# EAGLE design shield-ble (EAGLE 6.5.0)
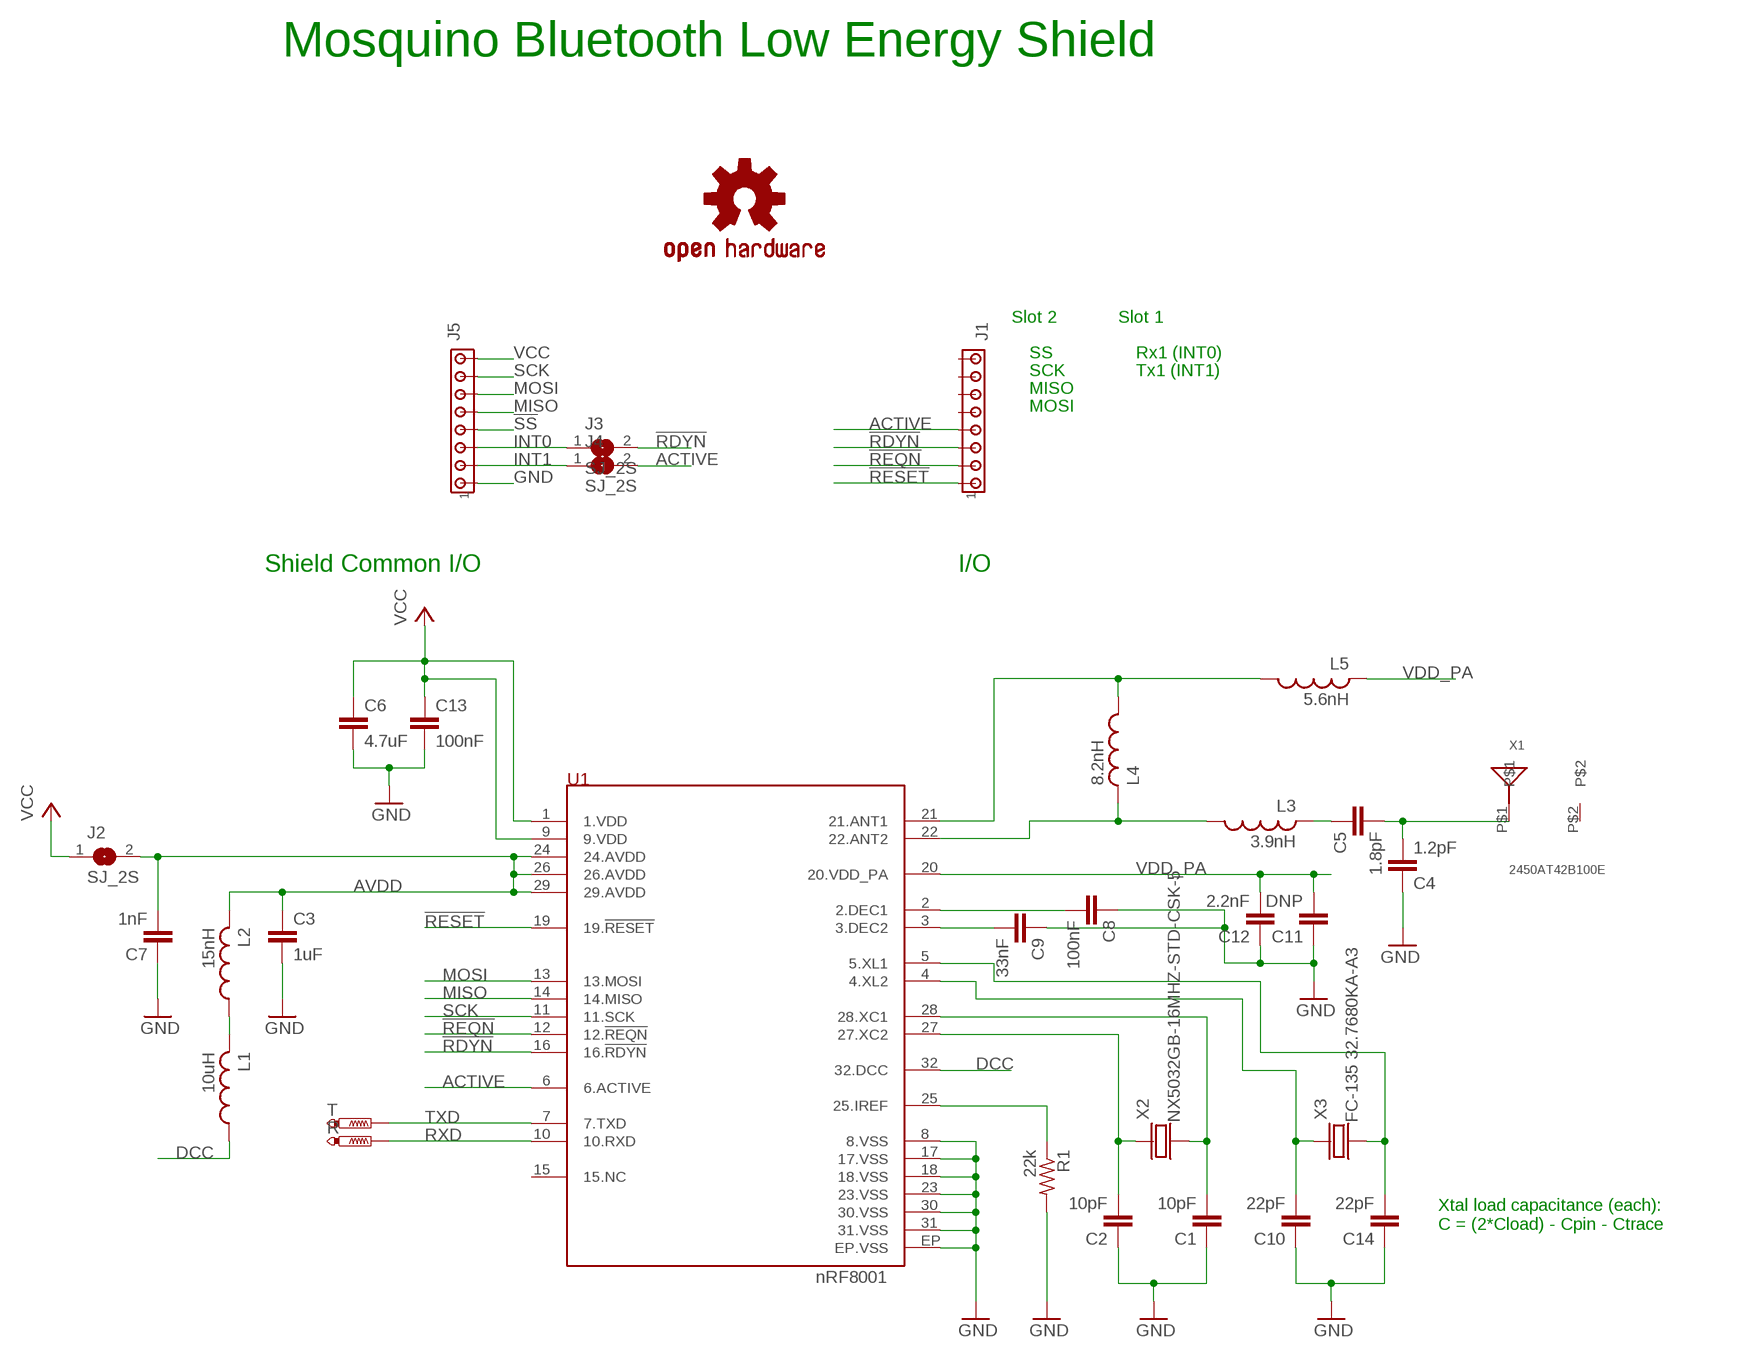
[diagram p0: schematic, sheet 1]

## Parts
C1  10pF  C-EUC0603  [C0603]
C2  10pF  C-EUC0603  [C0603]
C3  1uF  C-EUC0603  [C0603]
C4  1.2pF  C-EUC0603  [C0603]
C5  1.8pF  C-EUC0603  [C0603]
C6  4.7uF  C-EUC0603  [C0603]
C7  1nF  C-EUC0603  [C0603]
C8  100nF  C-EUC0603  [C0603]
C9  33nF  C-EUC0603  [C0603]
C10  22pF  C-EUC0603  [C0603]
C11  DNP  C-EUC0603  [C0603]
C12  2.2nF  C-EUC0603  [C0603]
C13  100nF  C-EUC0603  [C0603]
C14  22pF  C-EUC0603  [C0603]
J1  MTA08-100  [10X08MTA]
J2  SJ_2S  [SJ2_S]
J3  SJ_2S  [SJ2_S]
J4  SJ_2S  [SJ2_S]
J5  MTA08-100  [10X08MTA]
L1  10uH  L-GENERIC0603  [0603]
L2  15nH  L-GENERIC0603  [0603]
L3  3.9nH  L-GENERIC0603  [0603]
L4  8.2nH  L-GENERIC0603  [0603]
L5  5.6nH  L-GENERIC0603  [0603]
LOGO1  OSHW-LOGOS  [OSHW-LOGO-S]
R  PTR1PAD1-13  [P1-13]
R1  22k  R-US_R0603  [R0603]
T  PTR1PAD1-13  [P1-13]
U1  NRF8001_QFN32  [QFN-32]
X1  2450AT42B100E  ANTENNA_CHIP_5MMX2MM  [ANTENNA_CHIP_5MMX2MM]
X2  NX5032GB-16MHZ-STD-CSK-5  CRYSTAL_SMD_5X3POINT2MM  [CRYSTAL_SMD_5X3POINT2MM]
X3  FC-135 32.7680KA-A3  FC-135  [FC-135]

## Nets
!RDYN: J1.3 J3.2 U1.16(16.!RDYN)
!REQN: J1.2 U1.12(12.!REQN)
!RESET: J1.1 U1.19(19.!RESET)
!SS: J5.4
ACTIVE: J1.4 J4.2 U1.6(6.ACTIVE)
AVDD: C3.1 C7.2 J2.2 L2.2 U1.24(24.AVDD) U1.26(26.AVDD) U1.29(29.AVDD)
DCC: L1.1 U1.32(32.DCC)
GND: C1.1 C2.1 C3.2 C4.1 C6.2 C7.1 C8.1 C9.1 C10.1 C11.1 C12.1 C13.2 C14.1 J5.1 R1.2 U1.8(8.VSS) U1.17(17.VSS) U1.18(18.VSS) U1.23(23.VSS) U1.30(30.VSS) U1.31(31.VSS) U1.EP(EP.VSS)
INT0: J3.1 J5.3
INT1: J4.1 J5.2
MISO: J5.5 U1.14(14.MISO)
MOSI: J5.6 U1.13(13.MOSI)
N$4: L1.2 L2.1
N$5: C2.2 U1.27(27.XC2) X2.P$1(X1)
N$6: C1.2 U1.28(28.XC1) X2.P$2(X2)
N$7: C10.2 U1.4(4.XL2) X3.P$1(X1)
N$8: C14.2 U1.5(5.XL1) X3.P$2(X2)
N$15: C5.1 L3.2
N$16: L3.1 L4.2 U1.22(22.ANT2)
N$17: L4.1 L5.1 U1.21(21.ANT1)
N$18: C8.2 U1.2(2.DEC1)
N$19: C9.2 U1.3(3.DEC2)
N$21: R1.1 U1.25(25.IREF)
N$22: C4.2 C5.2 X1.P$1
RXD: R.TP U1.10(10.RXD)
SCK: J5.7 U1.11(11.SCK)
TXD: T.TP U1.7(7.TXD)
VCC: C6.1 C13.1 J2.1 J5.8 U1.1(1.VDD) U1.9(9.VDD)
VDD_PA: C11.2 C12.2 L5.2 U1.20(20.VDD_PA)
Unconnected: J1.5 J1.6 J1.7 J1.8 U1.15(15.NC) X1.P$2

## Notes on the sheet
- Mosquino Bluetooth Low Energy Shield
- Slot 2 | Slot 1
- SS | Rx1 (INT0)
- SCK | Tx1 (INT1)
- MISO
- MOSI
- Shield Common I/O | I/O
- Xtal load capacitance (each):
  C = (2*Cload) - Cpin - Ctrace

## Library data of the parts
C1-C14 = rcl:C-EU: CAPACITOR, European symbol
J1 J5 = con-amp:MTA08-100: AMP connector
J2-J4 = mideeval:SJ_2S: Small solder jumper, 2 pin. 20060130 / tgipson
L1-L5 = tim:L-GENERIC: Generic surface mount inductors - add more as needed. 20130906 / tgipson
LOGO1 = SparkFun-Aesthetics:OSHW-LOGO: Open Source Hardware Logo This logo indicates the piece of hardware it is found on incorporates a OSHW license and/or adheres to the definition of open source hardware found here: http://freedomdefined.org/OSHW
R T = testpad:PTR1: TEST PIN
R1 = rcl:R-US_: RESISTOR, American symbol
U1 = tim:NRF8001: nRF8100 Bluetooth Low Energy radio. Merged in from lostinspacebar / correct silkscreen and add center pad. 20130907 / tgipson
X1 = tim:ANTENNA_CHIP_5MMX2MM
X2 = mideeval:CRYSTAL_SMD_5X3POINT2MM
X3 = tim:FC-135

## Net classes
1 pwr: width 0.305 mm, drill 0.508 mm, clearance 0.203 mm
4 digital: width 0.203 mm, drill 0.381 mm, clearance 0.203 mm

## Board
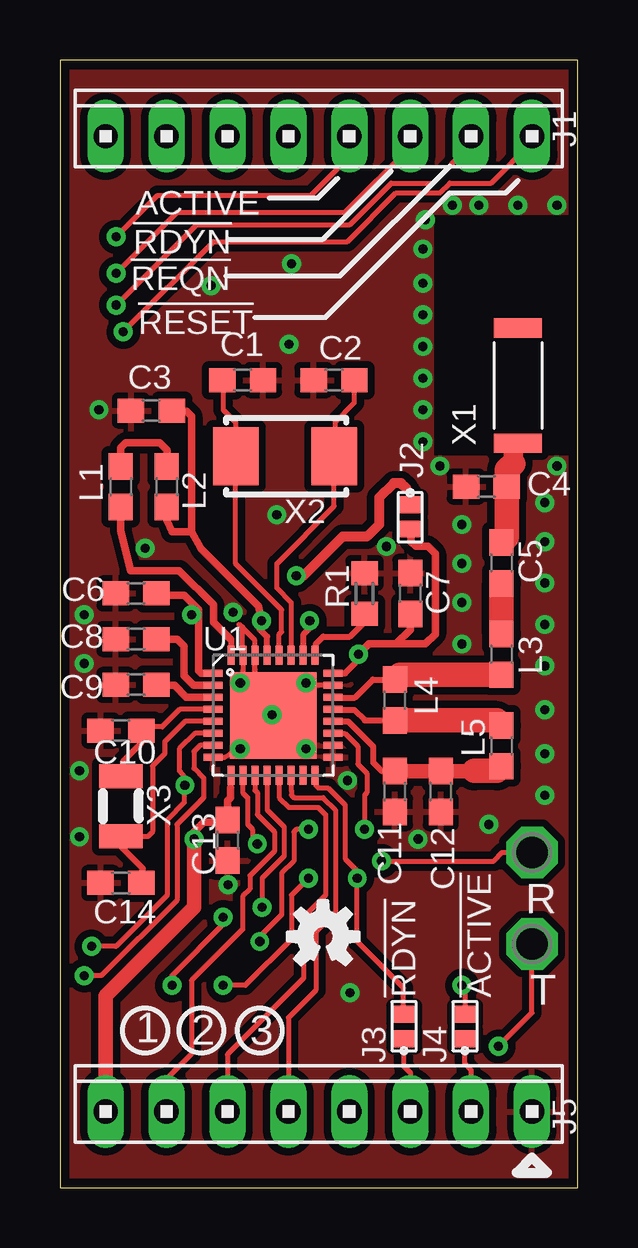
[diagram p1: board, top side]
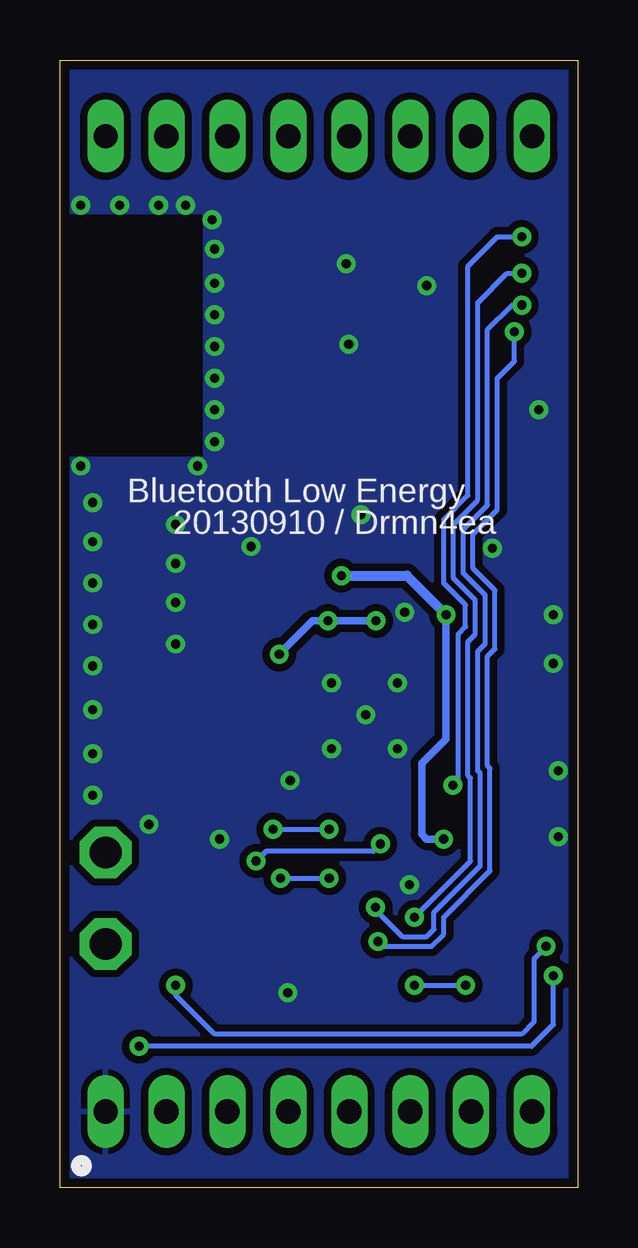
[diagram p2: board, bottom side, seen from below]

Size 21.59 x 46.99 mm. Coordinates in mm from the lower left corner, seen from the top.
Outline: 0,0 21.59,0 21.59,46.99 0,46.99 0,0
Copper layers (1*16): Top 0.035mm / dielectric 1.5mm / Bottom 0.035mm
Design rules "default *": minimum track width 8mil, minimum drill 15mil, track to track 8mil, track to pad 8mil, pad to pad 8mil, via to via 8mil, smd to smd 8mil, copper to edge 15mil, drill to drill 8mil, minimum pad ring 10mil, minimum via ring 8mil, stop-mask expansion 4mil, vias tented up to drill 0mil, thermal gap 10mil
tRestrict: area 8.6,21.5 to 9.1,21.6; area 10.7,19.5 to 10.8,19.9; area 8.6,17.8 to 9.1,17.9; area 7,19.5 to 7.1,19.9

### Footprints (pad centres in the part's own frame; a part is rotated, then mirrored left to right if it is on the bottom)
C0603 = smd 1.1 x 1: 1 -0.85,0; 2 0.85,0
10X08MTA = drill 1.016 long: 1 8.89,0; 2 6.35,0; 3 3.81,0; 4 1.27,0; 5 -1.27,0; 6 -3.81,0; 7 -6.35,0; 8 -8.89,0
SJ2_S = smd 0.7 x 0.9: 1 -0.523,0; 2 0.493,0
0603 = smd 1.1 x 1: 1 -0.85,0; 2 0.85,0
P1-13 = drill 1.321 pad 2.159 octagon: TP 0,0
R0603 = smd 1 x 1.1: 1 -0.85,0; 2 0.85,0
QFN-32 = smd 0.285 x 0.8: 1 -1.75,-2.5; 2 -1.25,-2.5; 3 -0.75,-2.5; 4 -0.25,-2.5; 5 0.25,-2.5; 6 0.75,-2.5; 7 1.25,-2.5; 8 1.75,-2.5; 17 1.75,2.5; 18 1.25,2.5; 19 0.75,2.5; 20 0.25,2.5; 21 -0.25,2.5; 22 -0.75,2.5; 23 -1.25,2.5; 24 -1.75,2.5 | smd 0.8 x 0.285: 9 2.5,-1.75; 10 2.5,-1.25; 11 2.5,-0.75; 12 2.5,-0.25; 13 2.5,0.25; 14 2.5,0.75; 15 2.5,1.25; 16 2.5,1.75; 25 -2.5,1.75; 26 -2.5,1.25; 27 -2.5,0.75; 28 -2.5,0.25; 29 -2.5,-0.25; 30 -2.5,-0.75; 31 -2.5,-1.25; 32 -2.5,-1.75 | smd 3.6 x 3.6: EP 0,0
ANTENNA_CHIP_5MMX2MM = smd 0.8 x 2: P$1 2.4,0; P$2 -2.4,0
CRYSTAL_SMD_5X3POINT2MM = smd 1.9 x 2.4: P$1 0,0; P$2 4.1,0
FC-135 = smd 1 x 1.8: P$1 0,0; P$2 2.5,0

### Placement (x,y rotation side)
C1  7.62,33.66 180 top
C2  11.43,33.66 0 top
C3  3.81,32.38 180 top
C4  17.78,29.21 0 top
C5  18.41,26.04 90 top
C6  3.17,24.77 180 top
C7  14.61,24.77 270 top
C8  3.17,22.86 0 top
C9  3.17,20.95 0 top
C10  2.54,19.05 0 top
C11  13.97,16.51 90 top
C12  15.88,16.51 90 top
C13  6.99,14.48 270 top
C14  2.54,12.7 0 top
J1  10.79,43.81 0 top
J2  14.61,27.94 270 top
J3  14.35,6.73 90 top
J4  16.89,6.73 90 top
J5  10.79,3.17 0 top
L1  2.54,29.21 90 top
L2  4.45,29.21 270 top
L3  18.41,22.23 90 top
L4  13.97,20.32 90 top
L5  18.41,18.41 270 top
LOGO1  10.97,10.46 0 top
R  19.68,13.97 180 top
R1  12.7,24.77 90 top
T  19.68,10.16 180 top
U1  8.89,19.68 270 top
X1  19.1,33.43 270 top
X2  11.43,30.48 180 top
X3  2.54,17.14 270 top

### Tracks (layer width: path | path; a pad name or v marks a point on that pad's centre or on a via)
!RDYN  (via drill 0.38)
  Top 0.203: 6.6,11.28 v6.81,11.28 6.81,10.97 4.67,8.84 v4.67,8.43 | U1.16 10.67,17.16 10.67,16.76 10.77,16.66 11.18,16.66 11.89,15.95 11.89,13.72 12.39,13.21 v12.39,12.9 12.39,10.26 14.33,8.33 14.33,7.25 J3.2 | v10.36,12.9 9.65,12.19 9.65,10.36 7.72,8.43 v6.81,8.43 | v2.34,38.1 4.88,40.64 11.89,40.64 14.61,43.36 J1.3
  Bottom 0.203: v6.81,11.28 4.47,13.61 4.47,17.07 4.57,17.17 4.57,22.76 4.27,23.06 4.27,24.49 5.18,25.4 5.18,27.64 4.17,28.65 4.17,36.88 2.95,38.1 v2.34,38.1 | v12.39,12.9 v10.36,12.9 | v6.81,8.43 v4.67,8.43
!REQN  (via drill 0.38)
  Top 0.203: U1.12 8.64,15.75 9.35,15.04 9.35,13.82 8.43,12.9 v8.43,11.68 8.43,11.58 | v2.34,36.78 5.69,40.13 12.09,40.13 13.82,41.86 15.54,41.86 17.14,43.46 J1.2
  Bottom 0.203: v2.34,36.78 2.74,36.78 3.76,35.76 3.76,28.45 4.78,27.43 4.78,25.6 3.86,24.69 3.86,22.66 4.17,22.35 4.17,17.37 4.06,17.27 4.06,13.41 5.99,11.48 5.99,10.77 6.3,10.46 7.32,10.46 8.43,11.58 v8.43,11.68
!RESET  (via drill 0.38)
  Top 0.203: U1.19 11.88,18.93 12.42,18.39 12.42,17.65 12.8,17.27 12.8,16.46 12.7,16.36 v12.7,14.94 | v10.36,14.94 9.86,14.94 9.75,14.83 9.75,13.61 9.25,13.11 9.25,11.38 8.33,10.46 v8.33,10.26 | v2.64,35.66 6.4,39.42 11.99,39.42 14.02,41.45 15.85,41.45 16.26,41.86 17.98,41.86 19.68,43.56 J1.1
  Bottom 0.203: v12.7,14.94 v10.36,14.94 | v8.33,10.26 8.33,10.06 6.1,10.06 5.59,10.57 5.59,11.28 3.66,13.21 3.66,17.48 3.76,17.58 3.76,22.15 3.45,22.45 3.45,24.89 4.37,25.81 4.37,27.23 3.35,28.25 3.35,33.73 2.64,34.44 v2.64,35.66
ACTIVE  (via drill 0.38)
  Top 0.203: U1.6 5.62,18.93 4.98,18.29 4.98,17.37 5.21,17.09 v5.21,16.76 5.18,16.74 5.18,16.05 4.47,15.34 4.47,12.19 2.34,10.06 v1.32,10.06 | v16.76,8.43 16.89,8.31 J4.2 | v2.34,39.62 4.06,41.35 10.46,41.35 12.06,42.95 J1.4
  Bottom 0.203: v5.21,16.76 4.98,16.99 4.98,23.06 4.67,23.37 4.67,24.28 5.59,25.2 5.59,27.84 4.57,28.85 4.57,38.41 3.35,39.62 v2.34,39.62 | v1.32,10.06 1.83,9.55 1.83,6.91 2.34,6.4 15.14,6.4 16.76,8.03 v16.76,8.43
AVDD  (via drill 0.38)
  Top 0.254: U1.29 8.64,22.96 8.31,23.29 v8.41,23.62 | U1.26 10.16,22.2 10.16,23.06 10.41,23.32 v10.41,23.62 | U1.24 11.89,21.44 12.45,22 v12.45,22.23
  Top 0.305: L2.2 4.47,28.34 4.47,27.79 4.67,27.33 5.49,27.33 | 5.49,27.33 5.89,26.62 8.28,24.23 v8.41,23.62 | C3.1 4.68,32.36 5.28,32.36 5.49,32.16 5.49,27.33 | v12.45,22.23 12.88,22.66 14.02,22.66 | 14.02,22.66 14.61,23.24 C7.2 | J2.2 14.63,27.42 14.63,26.92 14.83,26.72 15.34,26.72 15.65,26.42 15.65,23.06 15.24,22.66 14.02,22.66
  Bottom 0.305: v12.45,22.23 11.05,23.62 v10.41,23.62 v8.41,23.62
DCC
  Top 0.254: 7.11,22.86 7.14,22.83 U1.32
  Top 0.305: L1.1 2.54,27.38 2.95,25.7 4.98,25.7 6.4,24.28 6.4,23.57 7.11,22.86
GND  (via drill 0.38)
  Top 0.203: U1.23 10.36,20.93 v10.26,21.03 | U1.8 6.86,17.93 7.11,18.09 7.32,18.09 v7.52,18.29 | U1.31 7.64,21.15 v7.52,21.03 7.82,21.03 8.13,21.34 8.13,22.17 U1.30
  other vias: 13.61,26.72 3.56,26.64 7.01,12.62 7.21,23.98 20.73,40.94 19.1,40.94 17.48,40.94 16.36,40.94 15.24,40.34 15.14,39.12 15.14,37.69 15.14,36.37 15.14,35.05 15.14,33.73 15.14,32.41 15.14,31.09 15.85,30.07 1.02,23.88 1.02,21.84 0.81,17.37 0.81,14.63 11.99,16.97 14.94,14.53 8.84,19.71 10.26,18.29 16.76,27.64 16.76,26.01 16.76,24.38 16.76,22.66 20.73,30.07 20.22,28.55 20.22,26.92 20.22,25.2 20.22,23.47 20.22,21.74 20.22,19.91 20.22,18.08 20.22,16.36 17.88,15.14 12.09,8.13 9.04,28.04 1.63,32.41 9.55,35.15 9.65,38.51 6.3,37.59
  pour Top (isolate 0.305): -0.61,47.65 22.35,47.65 22.35,-0.71 -0.61,-0.71
  pour Bottom (isolate 0.305): 22.76,-1.02 -2.24,-1.02 -2.24,48.77 22.76,48.77
INT0
  Top 0.203: J3.1 14.33,6.18 14.33,5.08 14.61,4.8 J5.3
INT1
  Top 0.203: J4.1 16.87,6.18 16.87,5.18 17.14,4.9 J5.2
MISO
  Top 0.203: U1.14 9.64,16.57 9.65,16.56 9.65,16.36 9.75,16.26 10.97,16.26 11.48,15.75 11.48,11.48 10.67,10.67 10.67,8.23 9.53,7.09 J5.5
MOSI
  Top 0.203: U1.13 9.14,16.26 9.55,15.85 10.77,15.85 11.07,15.54 11.07,12.19 10.16,11.28 10.16,8.74 6.99,5.56 J5.6
N$1
  cutout Top: 21.46,40.52 21.46,30.53 15.62,30.53 15.62,40.52
N$4
  Top 0.305: L2.1 4.47,30.09 4.47,30.73 4.17,31.04 2.74,31.04 2.54,30.84 L1.2
N$5
  Top 0.203: U1.27 9.65,22.2 9.65,24.38 9.04,24.99 9.04,26.01 11.43,28.4 X2.P$1 11.48,30.53 11.48,31.9 12.28,32.7 C2.2
N$6
  Top 0.203: U1.28 9.14,23.06 9.25,23.16 9.25,24.08 7.33,26 X2.P$2 7.33,31.89 6.81,32.41 6.81,33.62 C1.2
N$7
  Top 0.203: U1.4 5,19.93 4.27,19.2 3.54,19.2 C10.2
  Top 0.254: X3.P$1 2.64,17.25 2.64,17.78 3.39,18.53 C10.2
N$8
  Top 0.203: U1.5 5.21,19.43 4.37,18.59 4.37,18.09 3.86,17.58 3.86,14.83 3.66,14.63 2.56,14.63 X3.P$2
  Top 0.254: C14.2 3.45,12.76 3.45,13.31 2.54,14.22 X3.P$2
N$9
  Top 0.203: 8.13,22.2 8.13,22.81 7.47,23.47
N$10
  Top 0.203: 7.62,22.35 7.62,23.37
N$13
  cutout Bottom: 15.65,30.48 15.65,40.54 21.44,40.54 21.44,30.48
N$15
  Top 1.016: L3.2 C5.1
N$16
  Top 0.254: U1.22 11.4,20.42 12.29,20.42 13.04,21.17 L4.2
  Top 1.016: L4.2 14.18,21.38 L3.1
N$17
  Top 0.254: U1.21 11.41,19.91 12.27,19.91 12.71,19.47 L4.1
  Top 1.016: L5.1 18.21,19.47 L4.1
N$18
  Top 0.305: U1.2 5.58,20.93 5.18,21.34 5.18,22.55 4.88,22.86 C8.2
N$19
  Top 0.305: U1.3 5.27,20.43 4.78,20.93 4.05,20.93 C9.2
N$21
  Top 0.254: U1.25 10.67,22.21 10.67,22.66 10.97,22.96 12.09,22.96 12.7,23.57 R1.1
N$22
  Top 0.813: 18.9,30.18 18.9,30.82 X1.P$1
  Top 1.016: C5.2 18.63,27.1 C4.2 18.63,29.91 18.9,30.18
RXD  (via drill 0.38)
  Top 0.203: U1.10 7.62,17.18 7.62,16.46 7.82,16.26 7.82,15.14 8.03,14.94 8.03,14.53 v8.23,14.33 | v13.41,13.61 18.09,13.61 18.44,13.97 R.TP
  Bottom 0.203: v8.23,14.33 8.53,14.02 13.01,14.02 v13.41,13.61
SCK
  Top 0.203: U1.11 8.13,17.17 8.13,16.56 8.23,16.46 8.23,15.54 8.94,14.83 8.94,14.02 7.92,13.01 7.92,12.45 7.62,12.14 7.62,10.77 5.49,8.64 5.49,5.59 4.45,4.55 J5.7
TXD  (via drill 0.38)
  Top 0.203: U1.7 5.84,18.43 5.59,18.19 5.59,17.48 5.99,17.07 5.99,16.26 4.88,15.14 4.88,11.99 1.73,8.84 v1.02,8.84 | v18.29,5.89 19.68,7.29 T.TP
  Bottom 0.203: v18.29,5.89 1.93,5.89 1.02,6.81 v1.02,8.84
VCC  (via drill 0.38)
  Top 0.254: U1.9 7.11,17.16 7.11,16.66
  Top 0.305: U1.1 5.89,21.43 5.79,21.54 5.79,24.08 | 5.79,24.08 5.18,24.69 4.1,24.69 C6.1 | 7.11,16.66 7.11,16.26 6.99,16.13 C13.1 6.9,15.24 5.99,15.24 5.59,14.83 v5.59,14.53 | J2.1 14.63,28.49 14.63,28.96 14.43,29.16 | 5.79,24.08 5.59,23.88 v5.49,23.88
  Top 0.406: 14.43,29.16 14.22,29.36 13.92,29.36 13.31,28.75 13.31,27.64 12.8,27.13 11.79,27.13 10.16,25.5 v9.86,25.5
  Top 0.61: v5.59,14.53 5.59,11.68 1.91,8 J5.8
  Bottom 0.305: v5.49,23.88 5.49,18.69 6.5,17.68 6.5,14.73 6.3,14.53 v5.59,14.53
  Bottom 0.406: v9.86,25.5 7.11,25.5 v5.49,23.88
VDD_PA
  Top 0.254: U1.20 12.01,19.43 13.06,18.39 13.06,17.73 13.43,17.36 C11.2
  Top 0.61: 17.27,17.37 17.26,17.36 C12.2 C11.2
  Top 1.016: L5.2 18.22,17.37 17.27,17.37

### Text on the board
tPlace: ACTIVE | !RDYN | !REQN | !RESET | !RDYN | !ACTIVE
bPlace: Bluetooth Low Energy | 20130910 / Drmn4ea
tNames: 1 | 2 | 3
Reference: Vcc | SCK | MOSI | MISO | SS\ | Rx1 | Tx1 | Gnd